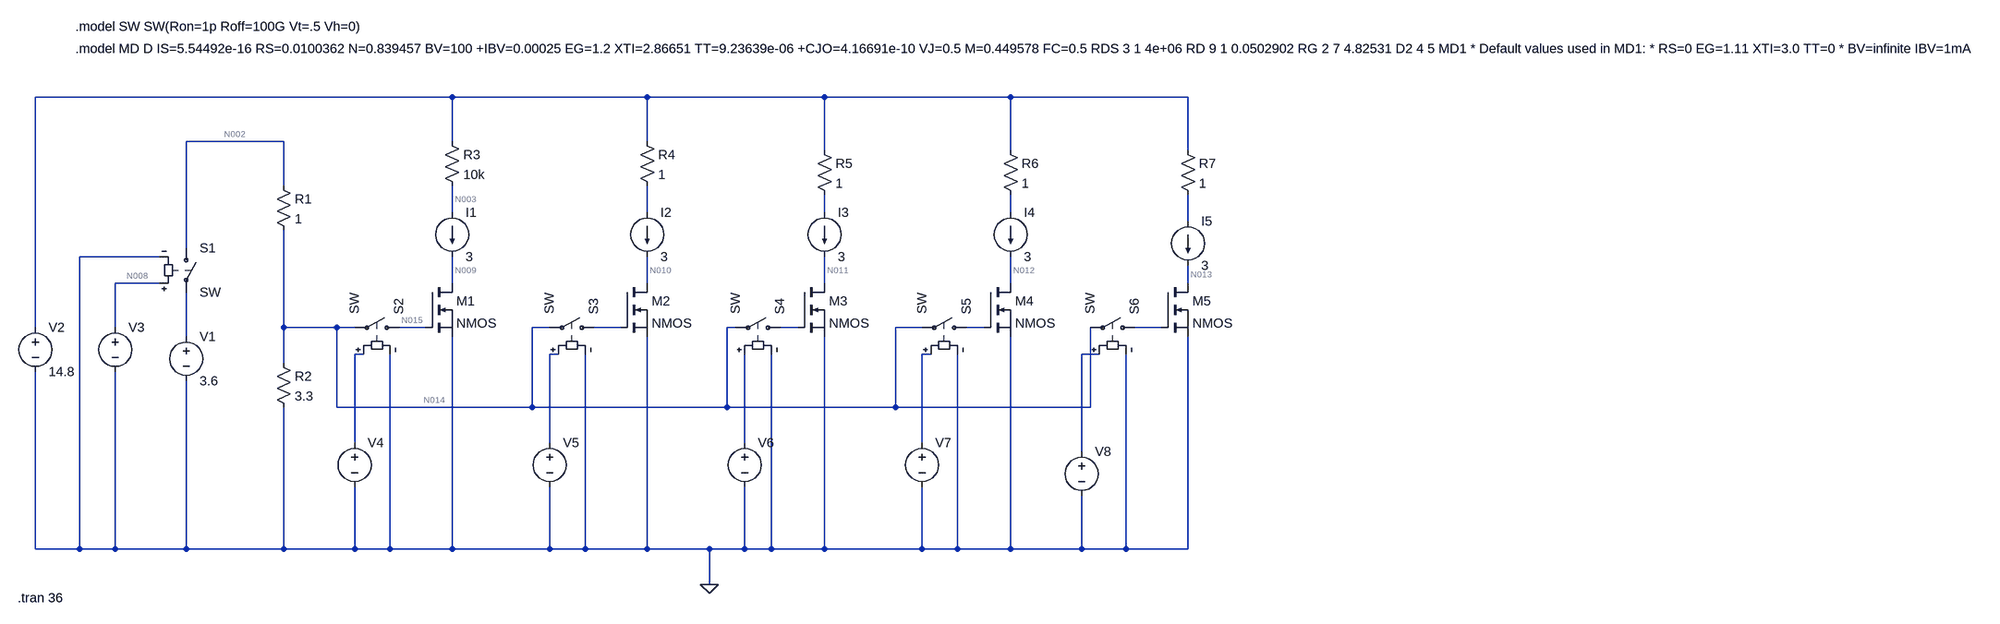
[diagram p0: schematic BreakBoard.asc]
BreakBoard.asc, the LTspice schematic file:
Version 4
SHEET 1 2792 680
WIRE -256 -528 -1008 -528
WIRE 96 -528 -256 -528
WIRE 416 -528 96 -528
WIRE 752 -528 416 -528
WIRE 1072 -528 752 -528
WIRE -560 -448 -736 -448
WIRE -256 -448 -256 -528
WIRE 96 -448 96 -528
WIRE 416 -432 416 -528
WIRE 752 -432 752 -528
WIRE 1072 -432 1072 -528
WIRE -560 -368 -560 -448
WIRE -256 -320 -256 -368
WIRE 96 -320 96 -368
WIRE 416 -320 416 -352
WIRE 752 -320 752 -352
WIRE 1072 -304 1072 -352
WIRE -736 -256 -736 -448
WIRE -784 -240 -928 -240
WIRE -784 -192 -864 -192
WIRE -256 -192 -256 -240
WIRE 96 -192 96 -240
WIRE 416 -192 416 -240
WIRE 752 -192 752 -240
WIRE 1072 -192 1072 -224
WIRE -1008 -112 -1008 -528
WIRE -864 -112 -864 -192
WIRE -560 -112 -560 -288
WIRE -464 -112 -560 -112
WIRE -432 -112 -464 -112
WIRE -304 -112 -352 -112
WIRE -80 -112 -112 -112
WIRE 48 -112 0 -112
WIRE 256 -112 240 -112
WIRE 368 -112 336 -112
WIRE 592 -112 544 -112
WIRE 704 -112 672 -112
WIRE 1024 -112 976 -112
WIRE -736 -96 -736 -176
WIRE -416 -64 -432 -64
WIRE -64 -64 -80 -64
WIRE 608 -64 592 -64
WIRE 912 -64 880 -64
WIRE -560 -48 -560 -112
WIRE -464 32 -464 -112
WIRE -112 32 -112 -112
WIRE -112 32 -464 32
WIRE 240 32 240 -112
WIRE 240 32 -112 32
WIRE 544 32 544 -112
WIRE 544 32 240 32
WIRE 896 32 896 -112
WIRE 896 32 544 32
WIRE -432 96 -432 -64
WIRE -80 96 -80 -64
WIRE 272 96 272 -64
WIRE 592 96 592 -64
WIRE 880 112 880 -64
WIRE -1008 288 -1008 -32
WIRE -928 288 -928 -240
WIRE -928 288 -1008 288
WIRE -864 288 -864 -32
WIRE -864 288 -928 288
WIRE -736 288 -736 -16
WIRE -736 288 -864 288
WIRE -560 288 -560 32
WIRE -560 288 -736 288
WIRE -432 288 -432 176
WIRE -432 288 -560 288
WIRE -368 288 -368 -64
WIRE -368 288 -432 288
WIRE -256 288 -256 -96
WIRE -256 288 -368 288
WIRE -80 288 -80 176
WIRE -80 288 -256 288
WIRE -16 288 -16 -64
WIRE -16 288 -80 288
WIRE 96 288 96 -96
WIRE 96 288 -16 288
WIRE 208 288 96 288
WIRE 272 288 272 176
WIRE 272 288 208 288
WIRE 320 288 320 -64
WIRE 320 288 272 288
WIRE 416 288 416 -96
WIRE 416 288 320 288
WIRE 592 288 592 176
WIRE 592 288 416 288
WIRE 656 288 656 -64
WIRE 656 288 592 288
WIRE 752 288 752 -96
WIRE 752 288 656 288
WIRE 880 288 880 192
WIRE 880 288 752 288
WIRE 960 288 960 -64
WIRE 960 288 880 288
WIRE 1072 288 1072 -96
WIRE 1072 288 960 288
WIRE 208 352 208 288
FLAG 208 352 0
SYMBOL voltage -736 -112 R0
WINDOW 123 0 0 Left 0
WINDOW 39 0 0 Left 0
SYMATTR InstName V1
SYMATTR Value 3.6
SYMBOL res -576 -384 R0
SYMATTR InstName R1
SYMATTR Value 1
SYMBOL res -576 -64 R0
SYMATTR InstName R2
SYMATTR Value 3.3
SYMBOL nmos 48 -192 R0
SYMATTR InstName M2
SYMBOL nmos 368 -192 R0
SYMATTR InstName M3
SYMBOL nmos 704 -192 R0
SYMATTR InstName M4
SYMBOL nmos 1024 -192 R0
SYMATTR InstName M5
SYMBOL nmos -304 -192 R0
SYMATTR InstName M1
SYMBOL voltage -1008 -128 R0
WINDOW 123 0 0 Left 0
WINDOW 39 0 0 Left 0
SYMATTR InstName V2
SYMATTR Value 14.8
SYMBOL sw -736 -272 R0
SYMATTR InstName S1
SYMBOL sw -336 -112 M270
SYMATTR InstName S2
SYMBOL sw 16 -112 M270
SYMATTR InstName S3
SYMBOL sw 352 -112 M270
SYMATTR InstName S4
SYMBOL sw 688 -112 M270
SYMATTR InstName S5
SYMBOL sw 992 -112 M270
SYMATTR InstName S6
SYMBOL voltage -864 -128 R0
WINDOW 3 24 96 Invisible 2
WINDOW 123 0 0 Left 0
WINDOW 39 0 0 Left 0
SYMATTR Value PULSE(0 5 10 1n 1n 5 10 1)
SYMATTR InstName V3
SYMBOL voltage -432 80 R0
WINDOW 3 24 96 Invisible 2
WINDOW 123 0 0 Left 0
WINDOW 39 0 0 Left 0
SYMATTR Value PULSE(0 5 0 1n 1n 4 20 1)
SYMATTR InstName V4
SYMBOL voltage -80 80 R0
WINDOW 3 24 96 Invisible 2
WINDOW 123 0 0 Left 0
WINDOW 39 0 0 Left 0
SYMATTR Value PULSE(0 5 0 1n 1n 30 10 1)
SYMATTR InstName V5
SYMBOL voltage 272 80 R0
WINDOW 3 24 96 Invisible 2
WINDOW 123 0 0 Left 0
WINDOW 39 0 0 Left 0
SYMATTR Value PULSE(0 5 12 1n 1n 30 20 1)
SYMATTR InstName V6
SYMBOL voltage 592 80 R0
WINDOW 3 24 96 Invisible 2
WINDOW 123 0 0 Left 0
WINDOW 39 0 0 Left 0
SYMATTR Value PULSE(0 5 18 1n 1n 30 10 1)
SYMATTR InstName V7
SYMBOL voltage 880 96 R0
WINDOW 3 24 96 Invisible 2
WINDOW 123 0 0 Left 0
WINDOW 39 0 0 Left 0
SYMATTR Value PULSE(0 5 24 1n 1n 30 10 1)
SYMATTR InstName V8
SYMBOL res -272 -464 R0
SYMATTR InstName R3
SYMATTR Value 10k
SYMBOL res 80 -464 R0
SYMATTR InstName R4
SYMATTR Value 1
SYMBOL res 400 -448 R0
SYMATTR InstName R5
SYMATTR Value 1
SYMBOL res 736 -448 R0
SYMATTR InstName R6
SYMATTR Value 1
SYMBOL res 1056 -448 R0
SYMATTR InstName R7
SYMATTR Value 1
SYMBOL load2 -256 -320 R0
WINDOW 123 0 0 Left 0
WINDOW 39 0 0 Left 0
SYMATTR InstName I1
SYMATTR Value 3
SYMBOL load2 96 -320 R0
WINDOW 123 0 0 Left 0
WINDOW 39 0 0 Left 0
SYMATTR InstName I2
SYMATTR Value 3
SYMBOL load2 416 -320 R0
WINDOW 123 0 0 Left 0
WINDOW 39 0 0 Left 0
SYMATTR InstName I3
SYMATTR Value 3
SYMBOL load2 752 -320 R0
WINDOW 123 0 0 Left 0
WINDOW 39 0 0 Left 0
SYMATTR InstName I4
SYMATTR Value 3
SYMBOL load2 1072 -304 R0
WINDOW 123 0 0 Left 0
WINDOW 39 0 0 Left 0
SYMATTR InstName I5
SYMATTR Value 3
TEXT -936 -616 Left 2 !.model MD D IS=5.54492e-16 RS=0.0100362 N=0.839457 BV=100 +IBV=0.00025 EG=1.2 XTI=2.86651 TT=9.23639e-06 +CJO=4.16691e-10 VJ=0.5 M=0.449578 FC=0.5 RDS 3 1 4e+06 RD 9 1 0.0502902 RG 2 7 4.82531 D2 4 5 MD1 * Default values used in MD1: * RS=0 EG=1.11 XTI=3.0 TT=0 * BV=infinite IBV=1mA
TEXT -936 -656 Left 2 !.model SW SW(Ron=1p Roff=100G Vt=.5 Vh=0)
TEXT -1040 376 Left 2 !.tran 36

The netlist it stands for:
* BreakBoard.asc
V1 N020 0 3.6
R1 N002 N014 1
R2 N014 0 3.3
M2 N010 N016 0 0 NMOS
M3 N011 N017 0 0 NMOS
M4 N012 N018 0 0 NMOS
M5 N013 N019 0 0 NMOS
M1 N009 N015 0 0 NMOS
V2 N001 0 14.8
S1 N002 N020 N008 0 SW
S2 N015 N014 N021 0 SW
S3 N016 N014 N022 0 SW
S4 N017 N014 N025 0 SW
S5 N018 N014 N023 0 SW
S6 N019 N014 N024 0 SW
V3 N008 0 PULSE(0 5 10 1n 1n 5 10 1)
V4 N021 0 PULSE(0 5 0 1n 1n 4 20 1)
V5 N022 0 PULSE(0 5 0 1n 1n 30 10 1)
V6 N025 0 PULSE(0 5 12 1n 1n 30 20 1)
V7 N023 0 PULSE(0 5 18 1n 1n 30 10 1)
V8 N024 0 PULSE(0 5 24 1n 1n 30 10 1)
R3 N001 N003 10k
R4 N001 N004 1
R5 N001 N005 1
R6 N001 N006 1
R7 N001 N007 1
I1 N003 N009 3
I2 N004 N010 3
I3 N005 N011 3
I4 N006 N012 3
I5 N007 N013 3
.model NMOS NMOS
.model PMOS PMOS
.lib standard.mos
.model MD D IS=5.54492e-16 RS=0.0100362 N=0.839457 BV=100 +IBV=0.00025 EG=1.2 XTI=2.86651 TT=9.23639e-06 +CJO=4.16691e-10 VJ=0.5 M=0.449578 FC=0.5 RDS 3 1 4e+06 RD 9 1 0.0502902 RG 2 7 4.82531 D2 4 5 MD1 * Default values used in MD1: * RS=0 EG=1.11 XTI=3.0 TT=0 * BV=infinite IBV=1mA
.model SW SW(Ron=1p Roff=100G Vt=.5 Vh=0)
.tran 36
.backanno
.end

* Results of the author's LTspice run, read from the files saved beside the schematic
* Operating Point, zero values left out:
*   V(n010) = 1.5 TV
*   V(n011) = 1.5 TV
*   V(n012) = 1.5 TV
*   V(n013) = 1.5 TV
*   V(n009) = 1.5 TV
*   V(n003) = -29.99 kV
*   Id(M1) = 3 A
*   Ib(M1) = -1.5 A
*   Is(M1) = -1.5 A
*   Id(M5) = 3 A
*   Ib(M5) = -1.5 A
*   Is(M5) = -1.5 A
*   Id(M4) = 3 A
*   Ib(M4) = -1.5 A
*   Is(M4) = -1.5 A
*   Id(M3) = 3 A
*   Ib(M3) = -1.5 A
*   Is(M3) = -1.5 A
*   Id(M2) = 3 A
*   Ib(M2) = -1.5 A
*   Is(M2) = -1.5 A
*   I(I5) = 3 A
*   I(I4) = 3 A
*   I(I3) = 3 A
*   I(I2) = 3 A
*   I(I1) = 3 A
*   I(R7) = 3 A
*   I(R6) = 3 A
*   I(R5) = 3 A
*   I(R4) = 3 A
*   I(R3) = 3 A
*   I(R2) = 39.6 pA
*   I(R1) = 39.6 pA
*   I(S1) = 39.6 pA
*   I(V2) = -15 A
*   I(V1) = -39.6 pA
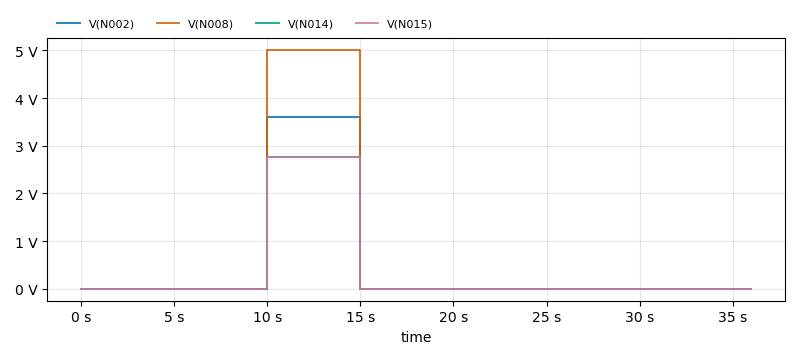
[diagram p1: Transient Analysis of BreakBoard.asc, plotted from the saved traces]
* Transient Analysis, 1 run:
*   V(N002): min 0 V, max 3.6 V, average 500 mV, rms 1.342 V, last 0 V
*   V(N008): min 0 V, max 5 V, average 694.4 mV, rms 1.863 V, last 0 V
*   V(N014): min 0 V, max 2.763 V, average 383.7 mV, rms 1.03 V, last 0 V
*   V(N015): min 0 V, max 2.763 V, average 383.7 mV, rms 1.03 V, last 0 V